# Altium schematic sheet Battery.SchDoc
size A4
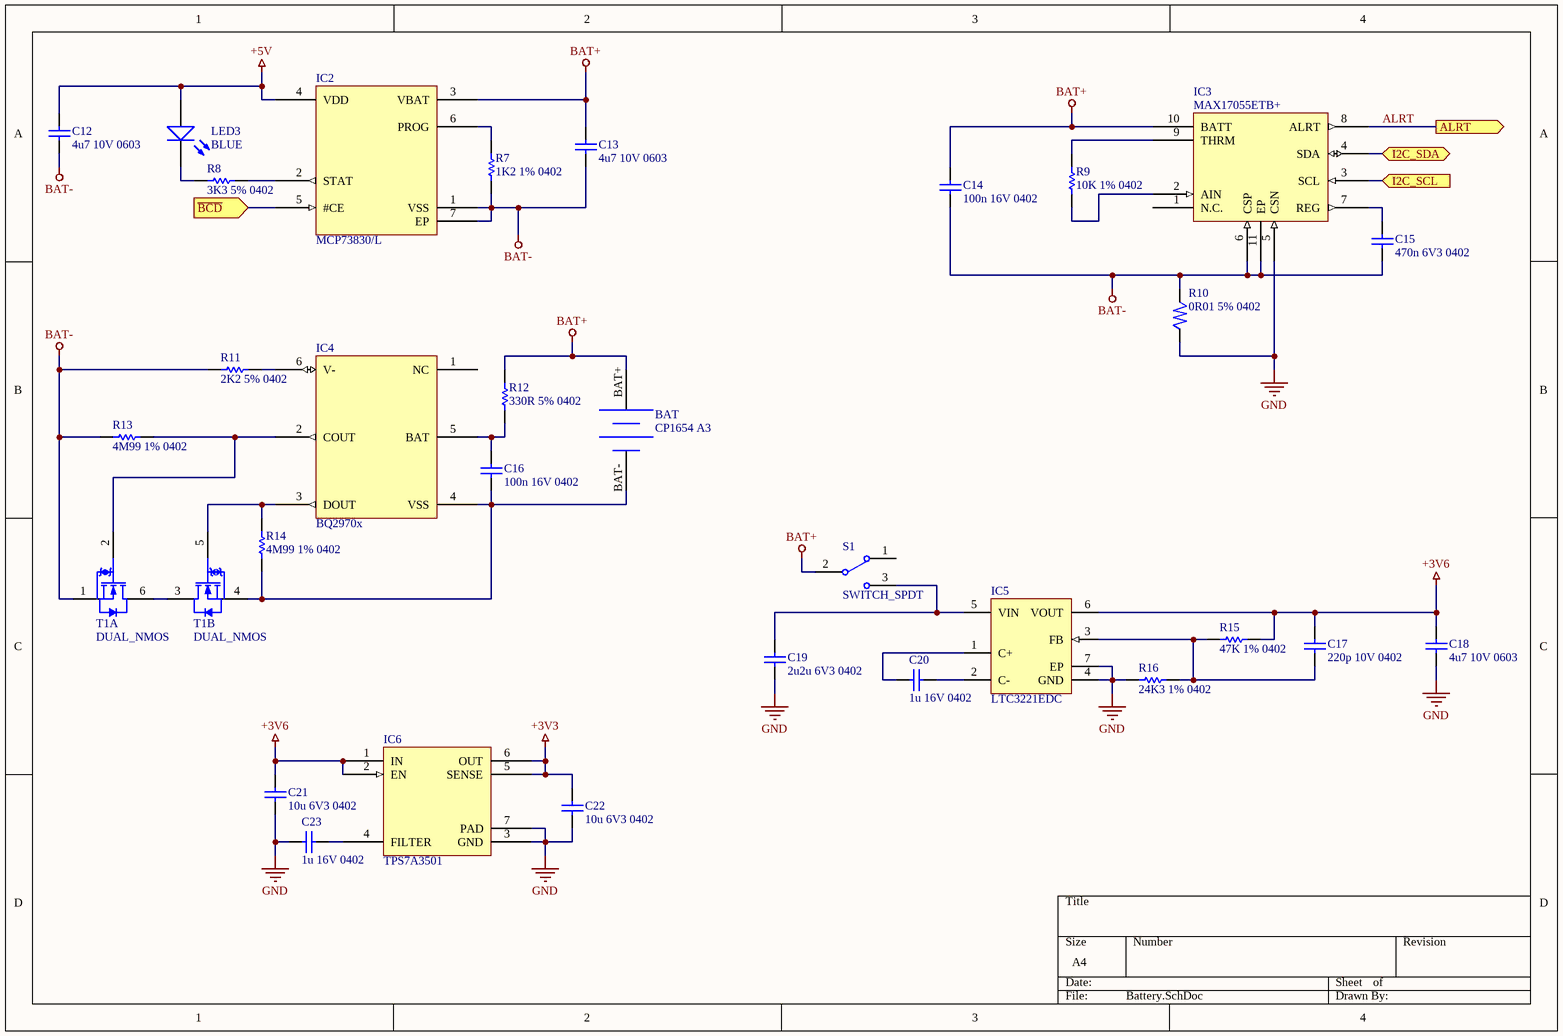
[diagram p0: Battery.SchDoc]

## Parts
BAT  CP1654 A3  [CP1654]
C12  4u7 10V 0603  [CAPC0603(1608)100_L]
C13  4u7 10V 0603  [CAPC0603(1608)100_L]
C14  100n 16V 0402  [CAPC0402(1005)60_L]
C15  470n 6V3 0402  [CAPC0402(1005)60_L]
C16  100n 16V 0402  [CAPC0402(1005)60_L]
C17  220p 10V 0402  [CAPC0402(1005)60_L]
C18  4u7 10V 0603  [CAPC0603(1608)100_L]
C19  2u2u 6V3 0402  [CAPC0402(1005)60_L]
C20  1u 16V 0402  [CAPC0402(1005)60_L]
C21  10u 6V3 0402  [CAPC0402(1005)60_L]
C22  10u 6V3 0402  [CAPC0402(1005)60_L]
C23  1u 16V 0402  [CAPC0402(1005)60_L]
IC2  MCP73830/L  [PSON50P200X80_HS-7L]
IC3  MAX17055ETB+  [PSON40P250X80_HS-11L]
IC4  BQ2970x  [SON50P150X80-6L]
IC5  LTC3221EDC  [LT-DC6-6_V]
IC6  TPS7A3501  [PSON65P200X80_HS-7L]
LED3  BLUE  [LED_0402]
R7  1K2 1% 0402  [RESC0402(1005)_L]
R8  3K3 5% 0402  [RESC0402(1005)_L]
R9  10K 1% 0402  [RESC0402(1005)_L]
R10  0R01 5% 0402  [R0402]
R11  2K2 5% 0402  [RESC0402(1005)_L]
R12  330R 5% 0402  [RESC0402(1005)_L]
R13  4M99 1% 0402  [RESC0402(1005)_L]
R14  4M99 1% 0402  [RESC0402(1005)_L]
R15  47K 1% 0402  [RESC0402(1005)_L]
R16  24K3 1% 0402  [RESC0402(1005)_L]
S1  SWITCH_SPDT  [SSSS810701_MODIFIED]
T1  DUAL_NMOS  [WDFN6 2x2, 0.65P]  (parts A,B of 2)

## Ports
ALRT (out), I2C_SCL (in), I2C_SDA (bidir), ~{BCD} (in)

## Nets
+3V3: C22.2 IC6.5(SENSE) IC6.6(OUT)
+3V6: C17.2 C18.2 C21.2 IC5.6(VOUT) IC6.1(IN) IC6.2(EN) R15.2
+5V: C12.2 IC2.4(VDD) LED3.ANODE
BAT+: BAT.BAT+ C13.2 C14.2 IC2.3(VBAT) IC3.10(BATT) R12.2 S1.2
BAT-: C12.1 C13.1 C14.1 C15.1 IC2.1(VSS) IC2.7(EP) IC3.6(CSP) IC3.11(EP) R7.1 R10.1 R11.1 R13.1 T1.1(S1)
GND: C18.1 C19.1 C21.1 C22.1 C23.2 IC3.5(CSN) IC5.4(GND) IC5.7(EP) IC6.3(GND) IC6.7(PAD) R10.2 R16.1
~{BCD}: IC2.5(#CE) ; port ~{BCD}
ALRT: IC3.8(ALRT) ; port ALRT
I2C_SCL: IC3.3(SCL) ; port I2C_SCL
I2C_SDA: IC3.4(SDA) ; port I2C_SDA
NetBAT_BAT-: BAT.BAT- C16.1 IC4.4(VSS) R14.1 T1.4(S2)
NetC15_2: C15.2 IC3.7(REG)
NetC16_2: C16.2 IC4.5(BAT) R12.1
NetC17_1: C17.1 IC5.3(FB) R15.1 R16.2
NetC19_2: C19.2 IC5.5(VIN) S1.3
NetC20_1: C20.1 IC5.2(C-)
NetC20_2: C20.2 IC5.1(C+)
NetC23_1: C23.1 IC6.4(FILTER)
NetIC2_2: IC2.2(STAT) R8.2
NetIC2_6: IC2.6(PROG) R7.2
NetIC3_2: IC3.2(AIN) R9.1
NetIC3_9: IC3.9(THRM) R9.2
NetIC4_2: IC4.2(COUT) R13.2 T1.2(G1)
NetIC4_3: IC4.3(DOUT) R14.2 T1.5(G2)
NetIC4_6: IC4.6(V-) R11.2
NetLED3_CATHODE: LED3.CATHODE R8.1
NetT1_3: T1.3(D2) T1.6(D1)

Not connected (* = marked no-connect by the designer): IC3 1(N.C.); IC4 1(NC); S1 1(2)

## Library data of the parts
BAT = Battery
C12 C13 C18 = CMP-1035-02787-1: CAP 4.7uF 10V ±20% 0603 (1608 Metric) Thickness 1mm SMD; Case-EIA: 0603; Case-Metric: 1608; Tolerance: Â±20%; Value: 4.7uF; Max Thickness: 1 mm; Technology: SMT; Rated Voltage: 10 V
C14 C16 = CMP-1034-02069-1: CAP 100nF 16V ±10% 0402 (1005 Metric) Thickness 0.6mm SMD; Case-EIA: 0402; Case-Metric: 1005; Tolerance: Â±10%; Value: 100nF; Max Thickness: 0.6 mm; Rated Voltage: 16 V; Technology: SMT
C15 = CMP-1034-02103-1: CAP 470nF 6.3V ±10% 0402 (1005 Metric) Thickness 0.6mm SMD; Tolerance: Â±10%; Case-Metric: 1005; Case-EIA: 0402; Rated Voltage: 6.3 V; Value: 470nF; Technology: SMT; Max Thickness: 0.6 mm
C17 = CMP-1034-01354-1: CAP 220pF 10V ±5% 0402 (1005 Metric) Thickness 0.6mm SMD; Case-Metric: 1005; Tolerance: Â±5%; Case-EIA: 0402; Rated Voltage: 10 V; Max Thickness: 0.6 mm; Technology: SMT; Value: 220pF
C19 = CMP-1034-02125-1: CAP 2.2uF 6.3V ±10% 0402 (1005 Metric) Thickness 0.6mm SMD; Case-Metric: 1005; Case-EIA: 0402; Tolerance: Â±10%; Value: 2.2uF; Technology: SMT; Rated Voltage: 6.3 V; Max Thickness: 0.6 mm
C20 C23 = CMP-1034-02119-1: CAP 1uF 16V ±10% 0402 (1005 Metric) Thickness 0.6mm SMD; Case-EIA: 0402; Tolerance: Â±10%; Case-Metric: 1005; Technology: SMT; Rated Voltage: 16 V; Max Thickness: 0.6 mm; Value: 1uF
C21 C22 = CMP-1034-02138-1: CAP 10uF 6.3V ±20% 0402 (1005 Metric) Thickness 0.6mm SMD; Case-Metric: 1005; Case-EIA: 0402; Tolerance: Â±20%; Rated Voltage: 6.3 V; Technology: SMT; Max Thickness: 0.6 mm; Value: 10uF
IC5 = CMP-0475-00008-3: Micropower, Regulated Charge Pump, 1.8 to 5.5 V Vin, Adjustable Vout, 6-pin SON (DC6-6), -40 to 85 degC; Manufacturer: Linear Technology; Voutput: Adj; Isupply(mA): 0.005; Vin Min(V): 1.8; Frequency(kHz): 600; Max Iout(mA): 60; Vin Max(V): 5.5; PackageDescription: 6-Pin Plastic DFN, Body 2 x 2 mm, Pitch 0.5 mm; ComponentLink3URL: http://cds.linear.com/docs/en/packaging/DFN_6_05-08-1703.pdf; RoHS: FALSE; Code_JEDEC: MO-229; ComponentLink1URL: http://www.linear.com/; ComponentLink1Description: Manufacturer URL; PackageVersion: Rev. B, 06/2010; ComponentLink3Description: Package Specification; ComponentLink2URL: http://cds.linear.com/docs/en/datasheet/3221f.pdf; ComponentLink2Description: Datasheet; Mounting Technology: Surface Mount; PartNumber: LTC3221EDC; PackageReference: DC6-6
LED3 = LED: Generic 0402 LED
R7 = CMP-1011-00518-1: 1K2 0.063W 1% 0402 (1005 Metric)  SMD; Value: 1200.00 Ohm; Case-EIA: 0402; Case-Metric: 1005; Technology: SMT; Power: 0.063 W; Tolerance: 1 %
R8 = CMP-1011-00086-1: 3K3 0.063W 5% 0402 (1005 Metric)  SMD; Case-EIA: 0402; Value: 3300.00 Ohm; Case-Metric: 1005; Power: 0.063 W; Technology: SMT; Tolerance: 5 %
R9 = CMP-1011-00623-1: 10K 0.063W 1% 0402 (1005 Metric)  SMD; Case-Metric: 1005; Value: 10000.00 Ohm; Case-EIA: 0402; Tolerance: 1 %; Technology: SMT; Power: 0.063 W
R10 = Resistor
R11 = CMP-1011-00082-1: 2K2 0.063W 5% 0402 (1005 Metric)  SMD; Value: 2200.00 Ohm; Case-EIA: 0402; Case-Metric: 1005; Tolerance: 5 %; Power: 0.063 W; Technology: SMT
R12 = CMP-1011-00062-1: 330R 0.063W 5% 0402 (1005 Metric)  SMD; Case-EIA: 0402; Value: 330.00 Ohm; Case-Metric: 1005; Tolerance: 5 %; Technology: SMT; Power: 0.063 W
R13 R14 = CMP-1011-00928-1: 4M99 0.063W 1% 0402 (1005 Metric)  SMD; Case-EIA: 0402; Case-Metric: 1005; Value: 4990000.00 Ohm; Technology: SMT; Tolerance: 1 %; Power: 0.063 W
R15 = CMP-1011-00699-1: 47K 0.063W 1% 0402 (1005 Metric)  SMD; Case-EIA: 0402; Case-Metric: 1005; Value: 47000.00 Ohm; Power: 0.063 W; Technology: SMT; Tolerance: 1 %
R16 = CMP-1011-00665-1: 24K3 0.063W 1% 0402 (1005 Metric)  SMD; Value: 24300.00 Ohm; Case-EIA: 0402; Case-Metric: 1005; Technology: SMT; Tolerance: 1 %; Power: 0.063 W